# Altium project PCB_Project.PrjPcb
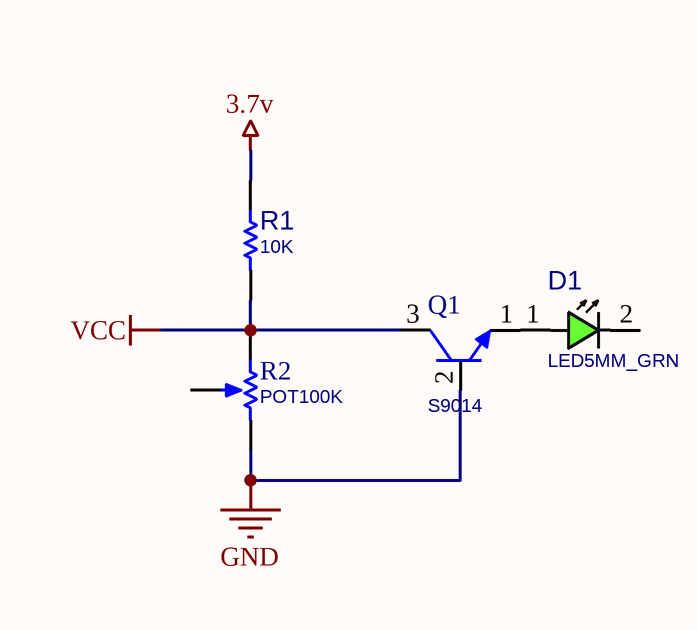
[diagram p0: Sheet2.SchDoc]
1 sheet, 4 parts. Net scope: global (net labels, ports and power ports of the same name join across sheets).
Board file: PCB1.PcbDoc

## Sheet Sheet2.SchDoc
size A4; SheetNumber: 1; SheetTotal: 1

### Parts
D1  LED5MM_GRN  [LED5MM_GRN]
Q1  S9014  [TO92_3]
R1  10K  [R025W_AX04]
R2  POT100K  [POT_7X5]

### Nets
3.7v: R1.1
GND: Q1.2(B) R2.3(BOT)
VCC: Q1.3(C) R1.2 R2.1(TOP)
NetD1_1: D1.1(ANODE) Q1.1(E)

Not connected (* = marked no-connect by the designer): D1 2(CATHODE); R2 2(TAP)

### Library data of the parts
D1 = LED_THD_5MM_GRN: LED, THD, 5MM, GREEN; DESC: DESCRIPTION; MANF_P#: MANF_PART#; PARAM2: 2.2V; MANF: MANF; ASSEMBLY: ASSEMBLY; PRICE: PRICE; VALUE: LED5MM_GRN
Q1 = NPN_S9014_TO92: BJT, NPN, 45v, 0.1A, THD, TO92; PARAM2: 450mW; PARAM: 45v, 0.1A; MANF_P#: S9014; MANF: -; VALUE: S9014
R1 = RES_THD: RESISTOR, THD; MANF_P#: RK73H1ETTP4701F; MANF: KOA SPEER; PARAM: 0.063W; DESC: DESCRIPTION; DIST#: MOUSER; PARAM2: 1%; ASSEMBLY: ASSEMBLY; PRICE: 100= 0.5$; VALUE: 10K
R2 = RES_THD_POT_7X5: RESISTOR, THD, Potentiometer; VALUE: POT100K